# Altium schematic sheet RGB_Matrix.SchDoc
size A
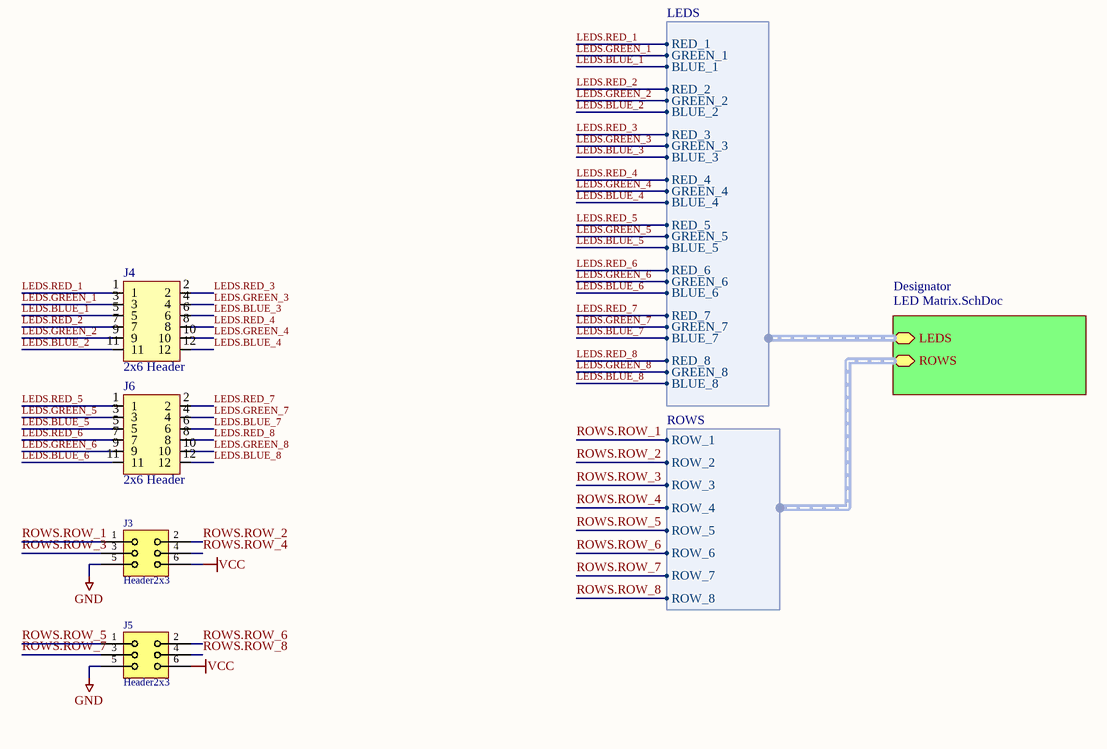
[diagram p0: RGB_Matrix.SchDoc]

## Parts
J3  Header2x3  [HDRV6W64P254_2X3_762X508X900B]
J4  2x6 Header  [2x6 Header]
J5  Header2x3  [HDRV6W64P254_2X3_762X508X900B]
J6  2x6 Header  [2x6 Header]

## Sub-sheets
Designator = LED Matrix.SchDoc: LEDS (harness LEDS), ROWS (harness ROWS)

## Harnesses
LEDS: BLUE_1, BLUE_2, BLUE_3, BLUE_4, BLUE_5, BLUE_6, BLUE_7, GREEN_1, GREEN_2, GREEN_3, GREEN_4, GREEN_5, GREEN_6, GREEN_7, GREEN_8, RED_1, RED_2, RED_3, RED_4, RED_5, RED_6, RED_7, RED_8, BLUE_8
ROWS: ROW_1, ROW_2, ROW_3, ROW_4, ROW_5, ROW_6, ROW_7, ROW_8

## Nets
GND: J3.5 J5.5
VCC: J3.6 J5.6
LEDS.BLUE_1: J4.5 ; sheet Designator/LEDS.BLUE_1
LEDS.BLUE_2: J4.11 ; sheet Designator/LEDS.BLUE_2
LEDS.BLUE_3: J4.6 ; sheet Designator/LEDS.BLUE_3
LEDS.BLUE_4: J4.12 ; sheet Designator/LEDS.BLUE_4
LEDS.BLUE_5: J6.5 ; sheet Designator/LEDS.BLUE_5
LEDS.BLUE_6: J6.11 ; sheet Designator/LEDS.BLUE_6
LEDS.BLUE_7: J6.6 ; sheet Designator/LEDS.BLUE_7
LEDS.BLUE_8: J6.12 ; sheet Designator/LEDS.BLUE_8
LEDS.GREEN_1: J4.3 ; sheet Designator/LEDS.GREEN_1
LEDS.GREEN_2: J4.9 ; sheet Designator/LEDS.GREEN_2
LEDS.GREEN_3: J4.4 ; sheet Designator/LEDS.GREEN_3
LEDS.GREEN_4: J4.10 ; sheet Designator/LEDS.GREEN_4
LEDS.GREEN_5: J6.3 ; sheet Designator/LEDS.GREEN_5
LEDS.GREEN_6: J6.9 ; sheet Designator/LEDS.GREEN_6
LEDS.GREEN_7: J6.4 ; sheet Designator/LEDS.GREEN_7
LEDS.GREEN_8: J6.10 ; sheet Designator/LEDS.GREEN_8
LEDS.RED_1: J4.1 ; sheet Designator/LEDS.RED_1
LEDS.RED_2: J4.7 ; sheet Designator/LEDS.RED_2
LEDS.RED_3: J4.2 ; sheet Designator/LEDS.RED_3
LEDS.RED_4: J4.8 ; sheet Designator/LEDS.RED_4
LEDS.RED_5: J6.1 ; sheet Designator/LEDS.RED_5
LEDS.RED_6: J6.7 ; sheet Designator/LEDS.RED_6
LEDS.RED_7: J6.2 ; sheet Designator/LEDS.RED_7
LEDS.RED_8: J6.8 ; sheet Designator/LEDS.RED_8
ROWS.ROW_1: J3.1 ; sheet Designator/ROWS.ROW_1
ROWS.ROW_2: J3.2 ; sheet Designator/ROWS.ROW_2
ROWS.ROW_3: J3.3 ; sheet Designator/ROWS.ROW_3
ROWS.ROW_4: J3.4 ; sheet Designator/ROWS.ROW_4
ROWS.ROW_5: J5.1 ; sheet Designator/ROWS.ROW_5
ROWS.ROW_6: J5.2 ; sheet Designator/ROWS.ROW_6
ROWS.ROW_7: J5.3 ; sheet Designator/ROWS.ROW_7
ROWS.ROW_8: J5.4 ; sheet Designator/ROWS.ROW_8

## Library data of the parts
J3 J5 = 3187: id: 3187; pakke_opprettet_av: 815; beskrivelse: 2,54mm pitch; pris: 3; pakketype: TH; pakke_opprettet: 7/23/2015 8:17:54 PM; symbol_opprettet_av: 815; symbol_opprettet: 11/13/2014 11:03:43 AM; navn: Header 2x3